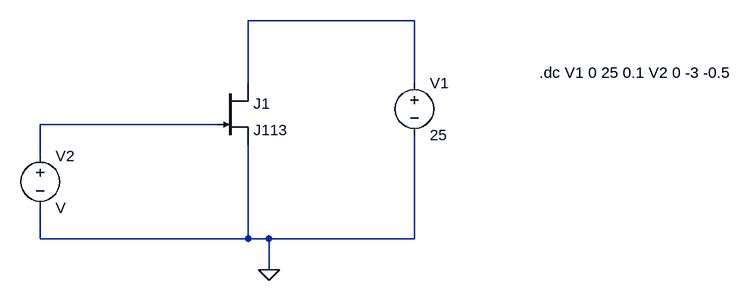
[diagram p0: schematic J113Characteristics.asc]
J113Characteristics.asc, the LTspice schematic file:
Version 4
SHEET 1 1212 680
WIRE 688 160 432 160
WIRE 432 256 432 160
WIRE 688 256 688 160
WIRE 384 320 112 320
WIRE 112 368 112 320
WIRE 112 496 112 448
WIRE 432 496 432 352
WIRE 432 496 112 496
WIRE 464 496 432 496
WIRE 688 496 688 336
WIRE 688 496 464 496
WIRE 464 544 464 496
FLAG 464 544 0
SYMBOL njf 384 256 R0
SYMATTR InstName J1
SYMATTR Value J113
SYMBOL Voltage 688 240 R0
SYMATTR InstName V1
SYMATTR Value 25
SYMBOL Voltage 112 352 R0
SYMATTR InstName V2
TEXT 880 240 Left 2 !.dc V1 0 25 0.1 V2 0 -3 -0.5

The netlist it stands for:
* J113Characteristics.asc
J1 N001 N002 0 J113
V1 N001 0 25
V2 N002 0 V
.model NJF NJF
.model PJF PJF
.lib standard.jft
.dc V1 0 25 0.1 V2 0 -3 -0.5
.backanno
.end